# Altium schematic sheet ВХ Б (1-6).SchDoc
size A3; Organization: Altium Limited; Address1: L3, 12a Rodborough Rd; Address2: Frenchs Forest; Address3: NSW; Address4: Australia 2086
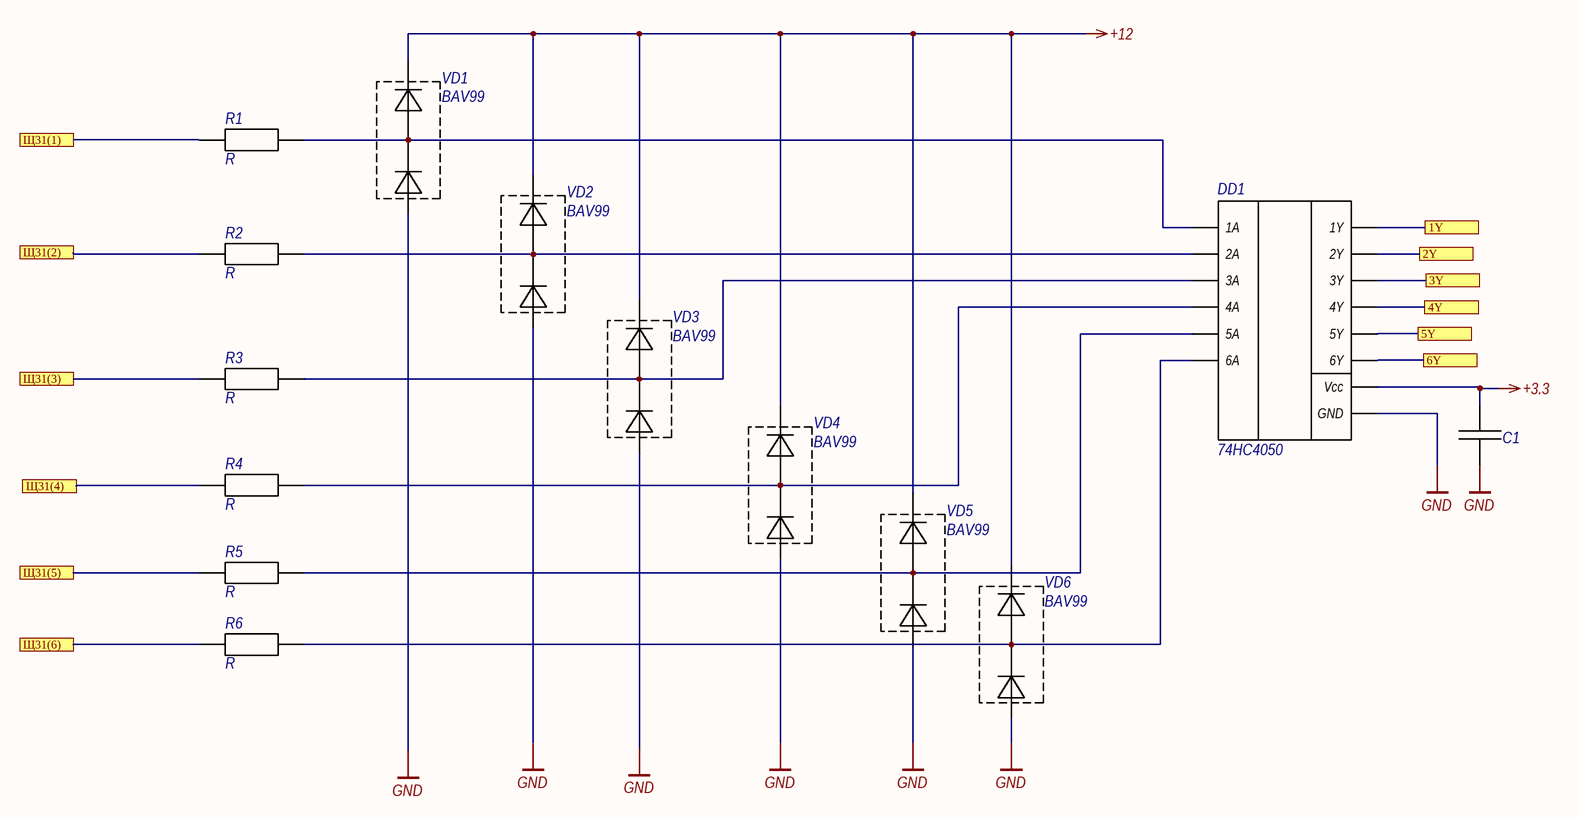
[diagram p0: ВХ Б (1-6).SchDoc]

## Parts
C1  C(ceramic)  [C(ceramic)]  (value not drawn)
DD1  74HC4050  [74HC4050(51)]
R1  R  [R]
R2  R  [R]
R3  R  [R]
R4  R  [R]
R5  R  [R]
R6  R  [R]
VD1  BAV99  [BAV99]
VD2  BAV99  [BAV99]
VD3  BAV99  [BAV99]
VD4  BAV99  [BAV99]
VD5  BAV99  [BAV99]
VD6  BAV99  [BAV99]

## Ports
1Y, 2Y, 3Y, 4Y, 5Y, 6Y, Щ31(1), Щ31(2), Щ31(3), Щ31(4), Щ31(5), Щ31(6)

## Nets
+3.3: C1.1 DD1.1(Vcc)
+12: VD1.2 VD2.2 VD3.2 VD4.2 VD5.2 VD6.2
GND: C1.2 DD1.8(GND) VD1.1 VD2.1 VD3.1 VD4.1 VD5.1 VD6.1
1Y: DD1.2(1Y) ; port 1Y
2Y: DD1.4(2Y) ; port 2Y
3Y: DD1.6(3Y) ; port 3Y
4Y: DD1.10(4Y) ; port 4Y
5Y: DD1.12(5Y) ; port 5Y
6Y: DD1.15(6Y) ; port 6Y
Щ31(1): R1.1 ; port Щ31(1)
Щ31(2): R2.1 ; port Щ31(2)
Щ31(3): R3.1 ; port Щ31(3)
Щ31(4): R4.1 ; port Щ31(4)
Щ31(5): R5.1 ; port Щ31(5)
Щ31(6): R6.1 ; port Щ31(6)
NetDD1_3: DD1.3(1A) R1.2 VD1.3
NetDD1_5: DD1.5(2A) R2.2 VD2.3
NetDD1_7: DD1.7(3A) R3.2 VD3.3
NetDD1_9: DD1.9(4A) R4.2 VD4.3
NetDD1_11: DD1.11(5A) R5.2 VD5.3
NetDD1_14: DD1.14(6A) R6.2 VD6.3

## Notes on the sheet
- Title
- Size:
- Date:
- A3
- Number:
- Time:
- Revision:
- Sheet
- of
- File: